# EAGLE design Adafruit ItsyBitsy M0 (EAGLE 9.4.2)
REV: 0.1
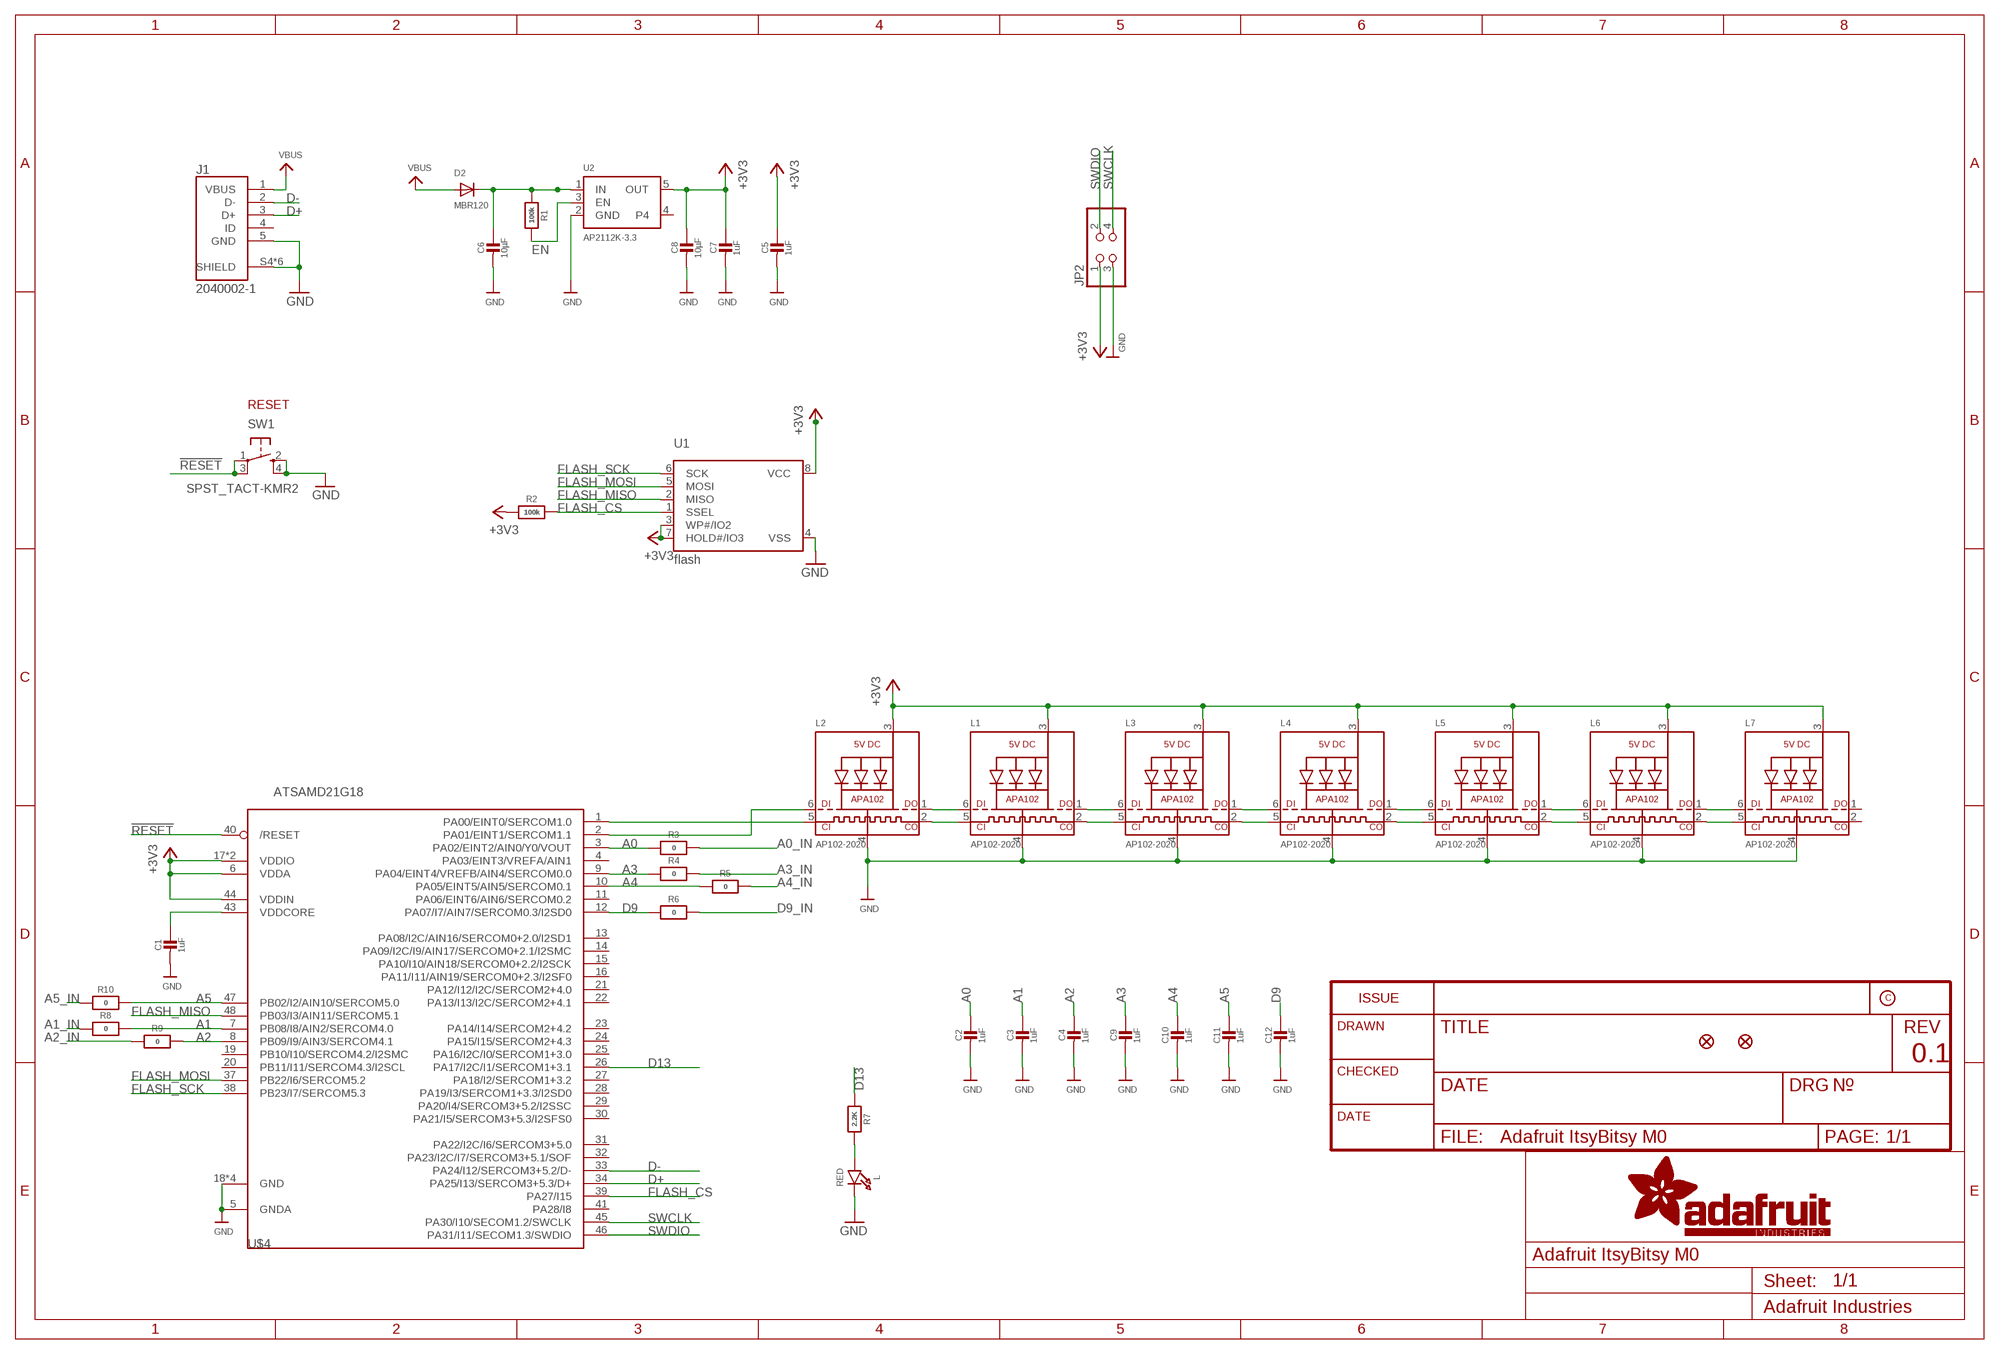
[diagram p0: schematic, sheet 1]

## Parts
C1  1uF  CAP_CERAMIC0603_NO  [0603-NO]
C2  1uF  CAP_CERAMIC0603_NO  [0603-NO]
C3  1uF  CAP_CERAMIC0603_NO  [0603-NO]
C4  1uF  CAP_CERAMIC0603_NO  [0603-NO]
C5  1uF  CAP_CERAMIC0603_NO  [0603-NO]
C6  10µF  CAP_CERAMIC0805-NOOUTLINE  [0805-NO]
C7  1uF  CAP_CERAMIC0603_NO  [0603-NO]
C8  10µF  CAP_CERAMIC0805-NOOUTLINE  [0805-NO]
C9  1uF  CAP_CERAMIC0603_NO  [0603-NO]
C10  1uF  CAP_CERAMIC0603_NO  [0603-NO]
C11  1uF  CAP_CERAMIC0603_NO  [0603-NO]
C12  1uF  CAP_CERAMIC0603_NO  [0603-NO]
D2  MBR120  DIODE_SOD-123FL  [SOD-123FL]
J1  2040002-1  [TE_2040002-1]
JP2  PINHD-2X2  [2X02]
L  RED  LED0805_NOOUTLINE  [CHIPLED_0805_NOOUTLINE]
L1  AP102-2020  APA1022020  [APA102_2020]
L2  AP102-2020  APA1022020  [APA102_2020]
L3  AP102-2020  APA1022020  [APA102_2020]
L4  AP102-2020  APA1022020  [APA102_2020]
L5  AP102-2020  APA1022020  [APA102_2020]
L6  AP102-2020  APA1022020  [APA102_2020]
L7  AP102-2020  APA1022020  [APA102_2020]
R1  100k  RESISTOR_0603_NOOUT  [0603-NO]
R2  100k  RESISTOR_0603_NOOUT  [0603-NO]
R3  0  RESISTOR_0603_NOOUT  [0603-NO]
R4  0  RESISTOR_0603_NOOUT  [0603-NO]
R5  0  RESISTOR_0603_NOOUT  [0603-NO]
R6  0  RESISTOR_0603_NOOUT  [0603-NO]
R7  2.2K  RESISTOR_0603_NOOUT  [0603-NO]
R8  0  RESISTOR_0603_NOOUT  [0603-NO]
R9  0  RESISTOR_0603_NOOUT  [0603-NO]
R10  0  RESISTOR_0603_NOOUT  [0603-NO]
SW1  SPST_TACT-KMR2  [KMR2]
U1  flash  SPIFLASH_8PINUX  [USON8]
U2  AP2112K-3.3  VREG_SOT23-5  [SOT23-5]
U$4  ATSAMD21G18  ATSAMD21G_QFN  [TQFN48_7MM]
U$34  FIDUCIAL_1MM  [FIDUCIAL_1MM]
U$35  FIDUCIAL_1MM  [FIDUCIAL_1MM]

## Nets
!RESET: SW1.1(P) SW1.3(P1) U$4.40(/RESET)
+3V3: C5.1 C7.1 C8.1 JP2.1 L1.3(VDD) L2.3(VDD) L3.3(VDD) L4.3(VDD) L5.3(VDD) L6.3(VDD) L7.3(VDD) R2.1 U1.3(WP#/IO2) U1.7(HOLD#/IO3) U1.8(VCC) U2.5(OUT) U$4.6(VDDA) U$4.17(VDDIO) U$4.36(VDDIO) U$4.44(VDDIN)
A0: C2.1 R3.1 U$4.3(PA02/EINT2/AIN0/Y0/VOUT)
A0_IN: R3.2
A1: C3.1 R8.2 U$4.7(PB08/I8/AIN2/SERCOM4.0)
A1_IN: R8.1
A2: C4.1 R9.2 U$4.8(PB09/I9/AIN3/SERCOM4.1)
A2_IN: R9.1
A3: C9.1 R4.1 U$4.9(PA04/EINT4/VREFB/AIN4/SERCOM0.0)
A3_IN: R4.2
A4: C10.1 R5.1 U$4.10(PA05/EINT5/AIN5/SERCOM0.1)
A4_IN: R5.2
A5: C11.1 R10.2 U$4.47(PB02/I2/AIN10/SERCOM5.0)
A5_IN: R10.1
D9: C12.1 R6.1 U$4.12(PA07/I7/AIN7/SERCOM0.3/I2SD0)
D9_IN: R6.2
D13: R7.1 U$4.26(PA17/I2C/I1/SERCOM1+3.1)
D+: J1.3(D+) U$4.34(PA25/I13/SERCOM3+5.3/D+)
D-: J1.2(D-) U$4.33(PA24/I12/SERCOM3+5.2/D-)
EN: R1.2 U2.3(EN)
FLASH_CS: R2.2 U1.1(SSEL) U$4.39(PA27/I15)
FLASH_MISO: U1.2(MISO) U$4.48(PB03/I3/AIN11/SERCOM5.1)
FLASH_MOSI: U1.5(MOSI) U$4.37(PB22/I6/SERCOM5.2)
FLASH_SCK: U1.6(SCK) U$4.38(PB23/I7/SERCOM5.3)
GND: C1.2 C2.2 C3.2 C4.2 C5.2 C6.2 C7.2 C8.2 C9.2 C10.2 C11.2 C12.2 J1.5(GND) J1.S4(SHIELD) J1.S5(SHIELD) J1.SH1(SHIELD) J1.SH2(SHIELD) J1.SH3(SHIELD) J1.SH4(SHIELD) JP2.3 L1.4(GND) L2.4(GND) L3.4(GND) L4.4(GND) L5.4(GND) L6.4(GND) L7.4(GND) L.C SW1.2(S) SW1.4(S1) U1.4(VSS) U2.2(GND) U$4.5(GNDA) U$4.18(GND) U$4.35(GND) U$4.42(GND) U$4.THERMAL(GND)
N$1: L2.5(CKI) U$4.1(PA00/EINT0/SERCOM1.0)
N$2: L.A R7.2
N$3: L1.6(DI) L2.1(DO)
N$4: L1.5(CKI) L2.2(CKO)
N$5: L2.6(DI) U$4.2(PA01/EINT1/SERCOM1.1)
N$6: L1.1(DO) L3.6(DI)
N$7: L1.2(CKO) L3.5(CKI)
N$8: L3.1(DO) L4.6(DI)
N$9: L3.2(CKO) L4.5(CKI)
N$10: L4.1(DO) L5.6(DI)
N$11: L4.2(CKO) L5.5(CKI)
N$12: L5.1(DO) L6.6(DI)
N$13: L5.2(CKO) L6.5(CKI)
N$14: L6.1(DO) L7.6(DI)
N$15: L6.2(CKO) L7.5(CKI)
SWCLK: JP2.4 U$4.45(PA30/I10/SECOM1.2/SWCLK)
SWDIO: JP2.2 U$4.46(PA31/I11/SECOM1.3/SWDIO)
VBUS: D2.A J1.1(VBUS)
VDDCORE: C1.1 U$4.43(VDDCORE)
VHI: C6.1 D2.C R1.1 U2.1(IN)
Unconnected: J1.4(ID) L7.1(DO) L7.2(CKO) U2.4 U$4.4(PA03/EINT3/VREFA/AIN1) U$4.11(PA06/EINT6/AIN6/SERCOM0.2) U$4.13(PA08/I2C/AIN16/SERCOM0+2.0/I2SD1) U$4.14(PA09/I2C/I9/AIN17/SERCOM0+2.1/I2SMC) U$4.15(PA10/I10/AIN18/SERCOM0+2.2/I2SCK) U$4.16(PA11/I11/AIN19/SERCOM0+2.3/I2SF0) U$4.19(PB10/I10/SERCOM4.2/I2SMC) U$4.20(PB11/I11/SERCOM4.3/I2SCL) U$4.21(PA12/I12/I2C/SERCOM2+4.0) U$4.22(PA13/I13/I2C/SERCOM2+4.1) U$4.23(PA14/I14/SERCOM2+4.2) U$4.24(PA15/I15/SERCOM2+4.3) U$4.25(PA16/I2C/I0/SERCOM1+3.0) U$4.27(PA18/I2/SERCOM1+3.2) U$4.28(PA19/I3/SERCOM1+3.3/I2SD0) U$4.29(PA20/I4/SERCOM3+5.2/I2SSC) U$4.30(PA21/I5/SERCOM3+5.3/I2SFS0) U$4.31(PA22/I2C/I6/SERCOM3+5.0) U$4.32(PA23/I2C/I7/SERCOM3+5.1/SOF) U$4.41(PA28/I8)

## Notes on the sheet
- RESET

## Library data of the parts
C1 C5 C7 = microbuilder:CAP_CERAMIC: Ceramic Capacitors For new designs, use the packages preceded by an '_' character since they are more reliable: The following footprints should be used on most boards: _0402 - Standard footprint for regular board layouts _0603 - Standard footprint for regular board layouts _0805 - Standard footprint for regular board layouts _1206 - Standard footprint for regular board layouts For extremely tight-pitch boards where space is at a premium, the following 'micro-pitch' footprints can be used (smaller pads, no silkscreen outline, etc.): _0402MP - Micro-pitch footprint for very dense/compact boards _0603MP - Micro-pitch footprint for very dense/compact boards _0805MP - Micro-pitch footprint for very dense/compact boards _1206MP - Micro-pitch footprint for very dense/compact boards; DK_PN: 399-17705-1-ND; JLC_PN: 1uF
C2-C4 C9-C12 = microbuilder:CAP_CERAMIC: Ceramic Capacitors For new designs, use the packages preceded by an '_' character since they are more reliable: The following footprints should be used on most boards: _0402 - Standard footprint for regular board layouts _0603 - Standard footprint for regular board layouts _0805 - Standard footprint for regular board layouts _1206 - Standard footprint for regular board layouts For extremely tight-pitch boards where space is at a premium, the following 'micro-pitch' footprints can be used (smaller pads, no silkscreen outline, etc.): _0402MP - Micro-pitch footprint for very dense/compact boards _0603MP - Micro-pitch footprint for very dense/compact boards _0805MP - Micro-pitch footprint for very dense/compact boards _1206MP - Micro-pitch footprint for very dense/compact boards
C6 C8 = microbuilder:CAP_CERAMIC: Ceramic Capacitors For new designs, use the packages preceded by an '_' character since they are more reliable: The following footprints should be used on most boards: _0402 - Standard footprint for regular board layouts _0603 - Standard footprint for regular board layouts _0805 - Standard footprint for regular board layouts _1206 - Standard footprint for regular board layouts For extremely tight-pitch boards where space is at a premium, the following 'micro-pitch' footprints can be used (smaller pads, no silkscreen outline, etc.): _0402MP - Micro-pitch footprint for very dense/compact boards _0603MP - Micro-pitch footprint for very dense/compact boards _0805MP - Micro-pitch footprint for very dense/compact boards _1206MP - Micro-pitch footprint for very dense/compact boards; DK_PN: 490-14381-1-ND; JLC_PN: 10uF
D2 = adafruit:DIODE: Diode SMADIODE - SMA Surface Mount Package 20V 1A Schottky Diode Digikey: 641-1014-6-ND DO-1N4148 - Through Hole Small Current Diode SOD-123 20V 1 A (.5mV Vf) Schottky Diode - Digikey: MBRX120TPMSCT-ND SOD-323 10V 570mA (.38mV Vf, 3ns) Schottky Diode - Digikey: ZLLS410CT-ND SOD-523 30V 30mA Schottky Diode (RB751S-40TE61) - Digikey: RB751S-40TE61CT-ND SOT23-R/W - SOT23 Package (R = Solder Paste/Reflow Ovens, W = Hand-Soldering) BAT54Film 40V 300mA - Digikey: 497-7162-1-ND; DK_PN: MBR120LSFT1GOSCT-ND; JLC_PN: MBR120LSF
J1 = 2040002-1:2040002-1: Conn USB Type B RCP 5 POS 0.65mm Solder RA SMD 5 Terminal 1 Port T/R; AVAILABILITY: Unavailable; CENTERLINE_PITCH: .65 mm[.025 in]; COMMENT: 2040002-1; DESCRIPTION: Conn Micro USB 2.0 Type B RCP 5 POS 0.65mm Solder RA SMD 5 Terminal 1 Port T/R; DK_PN: A108263CT-ND; MF: TE Connectivity; MP: 2040002-1; NUMBER_OF_POSITIONS: 5; PACKAGE: None; PN: 2040002-1; PRICE: None; PRODUCT_TYPE: Connector; TE_PURCHASE_URL: https://www.te.com/usa-en/product-2040002-1.html?te_bu=Cor&te_type=disp&te_campaign=seda_glo_cor-seda-global-disp-prtnr-fy19-seda-model-bom-cta_sma-317_1&elqCampaignId=32493
JP2 = pinhead:PINHD-2X2: PIN HEADER
L = microbuilder:LED: LED 0603 - 0603 Surface Mount Package 2mA: Green LED - Low Power (3.9mcd, 2ma, 1.7Vf) - Digikey: 475-2709-2-ND Orange LED - Low Power (9.8mcd, 2ma, 1.8Vf) - Digikey: 475-1194-2-ND Red LED - Low Power (5mcd, 2ma, 1.8Vf) - Digikey: 475-1195-2-ND Yellow LED - Low Power (7mcd, 2ma, 1.8Vf) - Digikey: 475-1196-2-ND 5mA: Blue LED - Low Power (17mcd, 5ma, 2.9Vf) - Digikey: LNJ937W8CRACT-ND 0805 - 0805 Surface Mount Package 2mA: Red LED (8.8mcd, 2mA, 1.8Vf, Clear) - Low Power [Digikey: 475-2510-1-ND] Green LED (5mcd, 2mA, 1.8Vf, Clear) - Low Power [Digikey: 475-2730-1-ND] Yellow LED (11.3mcd, 2mA, 1.8Vf, Clear) - Low Power [Digikey: 475-2555-1-ND] 20mA: Red LED (104mcd, 20mA, Diffused) - LS R976 [Digikey: 475-1278-6-ND] Red LED (12mcd, 20mA, 2.0Vf, Clear) - APT2012EC [Digikey: 754-1128-1-ND] Green LED (15mcd, 20mA, 2.2Vf, Clear) - APT2012GC [Digikey: 754-1131-1-ND] Orange LED (160mcd, 20mA, 2.1Vf, Clear) - APT2012SECK [Digikey: 754-1130-1-ND] 1206 - 1206 Surface Mount Package Green LED (26mcd, 20mA, Diffused) - LG N971 [Digikey: 475-1407-6-ND] Red LED (15mcd, 20mA, Diffused) - LH N974 [Digikey: 475-1416-6-ND] Cree - Cree High-Power Surface Mount LEDs XPEBWT-L1-0000-00D50 - White 111lm 350mA 2.9Vf 6200K 110° XTEAWT-00-0000-00000LEE3 - White 114lm 350mA 2.85Vf 5000K 115° Everlight - Everlight 45-21 Series Surface Mount LEDs 45-21/QK2C-B2832AC2CB2/2T - Warm White 2000mcd 20mA 3.25Vf 3050K 120° 45-21/LK2C-B38452C4CB2/2T - Nuetral White 2000mcd 20mA 3.25Vf 4150K 120° 45-21/LK2C-B50634C6CB2/2T - Cold White 2200mcd 20mA 3.25Vf 5650K 120° PLCC2 Reverse Mount LS T77K-J1L2-1-0-2-R18-Z - Red 11.25mcd 2mA 1.8Vf 630nm 120° LO T77K-L1M2-24-Z - Orange 19.6mcd 2mA 1.8Vf 606nm 120° LY T77K-K2M1-26-Z - Yellow 15.7mcd 2mA 1.8Vf 587nm 120°; DK_PN: 475-1415-1-ND; JLC_PN: RED LED
L1-L7 = microbuilder:APA102: APA102/DotStar Pixels VCC: 5V DC Refresh Rate: 400Hz; DK_PN: 1528-1826-ND; PN: 3341
R1 R2 = microbuilder:RESISTOR: Resistors For new designs, use the packages preceded by an '_' character since they are more reliable: The following footprints should be used on most boards: _0402 - Standard footprint for regular board layouts _0603 - Standard footprint for regular board layouts _0805 - Standard footprint for regular board layouts _1206 - Standard footprint for regular board layouts For extremely tight-pitch boards where space is at a premium, the following 'micro-pitch' footprints can be used (smaller pads, no silkscreen outline, etc.): _0402MP - Micro-pitch footprint for very dense/compact boards _0603MP - Micro-pitch footprint for very dense/compact boards _0805MP - Micro-pitch footprint for very dense/compact boards _1206MP - Micro-pitch footprint for very dense/compact boards; DK_PN: P100KDBCT-ND; JLC_PN: 100k
R3-R6 R8-R10 = microbuilder:RESISTOR: Resistors For new designs, use the packages preceded by an '_' character since they are more reliable: The following footprints should be used on most boards: _0402 - Standard footprint for regular board layouts _0603 - Standard footprint for regular board layouts _0805 - Standard footprint for regular board layouts _1206 - Standard footprint for regular board layouts For extremely tight-pitch boards where space is at a premium, the following 'micro-pitch' footprints can be used (smaller pads, no silkscreen outline, etc.): _0402MP - Micro-pitch footprint for very dense/compact boards _0603MP - Micro-pitch footprint for very dense/compact boards _0805MP - Micro-pitch footprint for very dense/compact boards _1206MP - Micro-pitch footprint for very dense/compact boards; DK_PN: P0.0GCT-ND; JLC_PN: 0
R7 = microbuilder:RESISTOR: Resistors For new designs, use the packages preceded by an '_' character since they are more reliable: The following footprints should be used on most boards: _0402 - Standard footprint for regular board layouts _0603 - Standard footprint for regular board layouts _0805 - Standard footprint for regular board layouts _1206 - Standard footprint for regular board layouts For extremely tight-pitch boards where space is at a premium, the following 'micro-pitch' footprints can be used (smaller pads, no silkscreen outline, etc.): _0402MP - Micro-pitch footprint for very dense/compact boards _0603MP - Micro-pitch footprint for very dense/compact boards _0805MP - Micro-pitch footprint for very dense/compact boards _1206MP - Micro-pitch footprint for very dense/compact boards; DK_PN: P2.2KDBCT-ND; JLC_PN: 2.2k
SW1 = adafruit:SPST_TACT: SMT 6mm switch, EVQQ2 series http://www.ladyada.net/library/eagle; DK_PN: 401-1426-1-ND; PN: KMR211GLFS
U1 = microbuilder:SPIFLASH_8PIN: SOIC8 SPI Flash Be careful with the size since SOIC8 flash comes in several 'widths' SOIC8 150 mil M25P16 - 16Mbit (2Mbit x 8) Serial Flash (75MHz SPI Bus), Supply: 2.7-3.6V Digikey: SOIC8 - M25P16-VMN6P-ND SOIC8 208 mil W25Q16BVSSIG - 16Mbit (2Mbit x 8) Serial Flash (104MHz SPI Bus), Supply: 2.7-3.6V Digikey: SOIC8 - W25Q16BVSSIG-ND; DK_PN: 1092-1184-1-ND; PN: MX25R2035FZUIL0
U2 = microbuilder:VREG_SOT23-5: SOT23-5 Fixed Voltage Regulators Part Current Out V Out V In V Dropout θJA (°C/W) TJ (°C) Digikey Part No. ADP121 150mA 3.3V 3.4-5.5V 0.09V @ 150mA -- -- ADP121-AUJZ33R7CT-ND ADP121 150mA 3.0V 3.1-5.5V 0.09V @ 150mA -- -- ADP121-AUJZ30R7CT-ND ADP122 300mA 3.3V 3.4-5.5V 0.085V @ 300mA -- -- ADP122AUJZ-3.3-R7CT-ND ADP1712 300mA 3.3V 3.5-5.5V 0.17V @ 300mA -- -- ADP1712AUJZ-3.3-R7TR-ND AP7311 (Low Cost) 150mA 3.3V 3.5-6V 0.15V @ 150mA -- -- AP7311-33WG-7DICT-ND LD39015M18R 150mA 1.8V 1.9V-5.5V 0.08V @ 100mA -- -- 497-6977-1-ND LP2985A-33DBVR 150mA 3.3V 3.3-16V 0.28V @ 150mA 206 150 296-18479-1-ND MCP1824T-3302E/OT 300mA 3.3V 3.5V-6V 0.2V @ 300mA -- -- MCP1824T-3302E/OTCT-ND MIC5205-2.5YM5 TR 150mA 2.5V 2.7-16V 0.165V @ 150mA -- -- 576-1257-2-ND MIC5205-3.0YM5 TR 150mA 3.0V 3.2V-16V 0.165V @ 150mA -- -- 576-1258-2-ND MIC5205-3.3YM5 TR 150mA 3.3V 3.5V-16V 0.165V @ 150mA -- -- 576-1259-2-ND TPS780330220 150mA 3.3V+2.2V 3.6-5.5V 250mV Max -- -- 296-23332-1-ND TDA3663/N1,135 100mA 3.3V 3.5-45V 0.18V @ 50mA -- -- 568-5343-1-ND Max operating temp can be calculated using θJA, TJ (max junction temperature), and power in watts. Set the "Maximum Ambient Temperature" until it reaches TJ ("Max Junction Temperature"), which is the absolute limit for safe use of the regulator: Heat Sink Temperature Calculator <http://www.daycounter.com/Calculators/Heat-Sink-Temperature-Calculator.phtml> For example, With 12V source into a 3.3V LP2985 and a 30mA load, we are dissipating (12V-3.3V) * 0.03A = 0.261W. With a θJA of 206 °C/W, a TJ of 150°C, and 261mW we can safely use the chip without a heat sink up to 75°C (=147.1°C Junction Temperature).; DK_PN: AP2112K-3.3TRG1DICT-ND; JLC_PN: AP2112K-3.3TRG1; PN: AP2112K-3.3TRG1
U$4 = microbuilder:ATSAMD21G; DK_PN: ATSAMD21G18A-MU-ND; PN: ATSAMD21G18A-MU
U$34 U$35 = microbuilder:FIDUCIAL: Fiducial Alignment Points Various fiducial points for machine vision alignment.; BOM: EXCLUDE

## Board
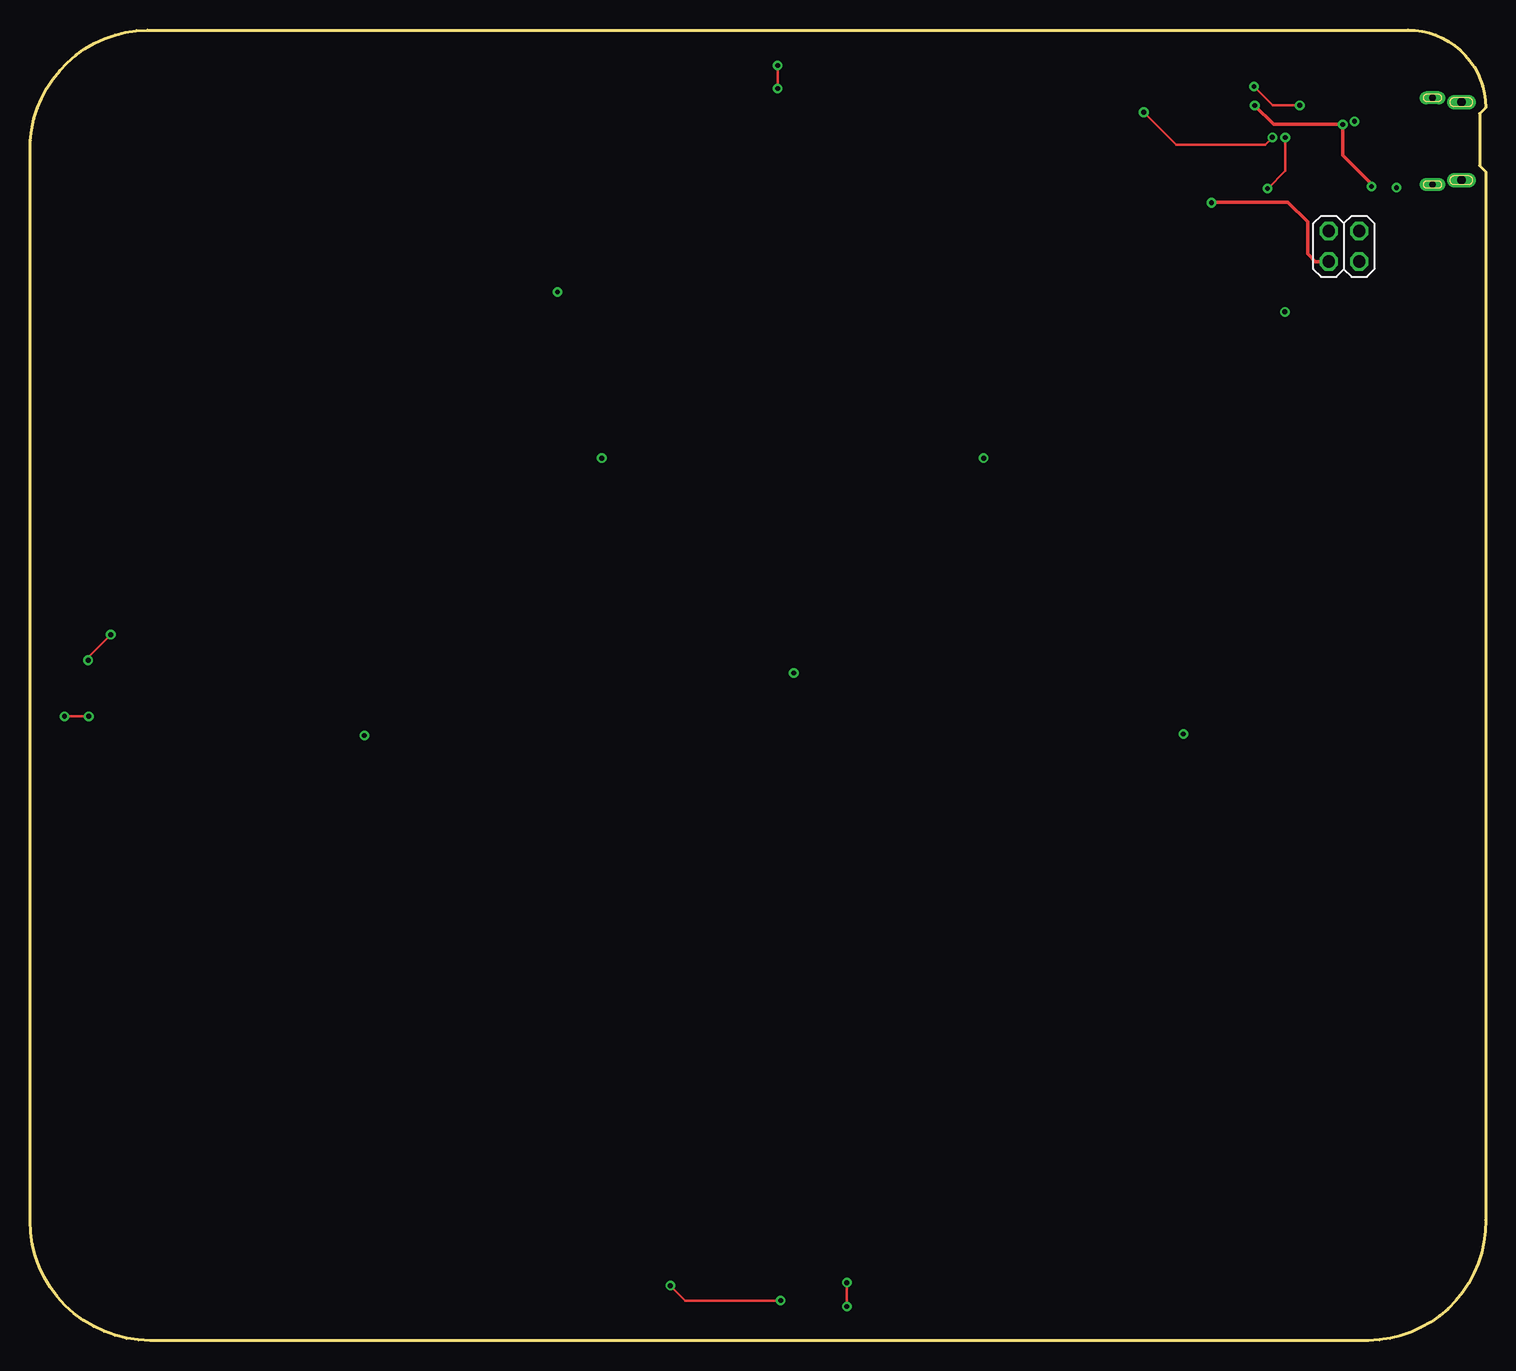
[diagram p1: board, top side]
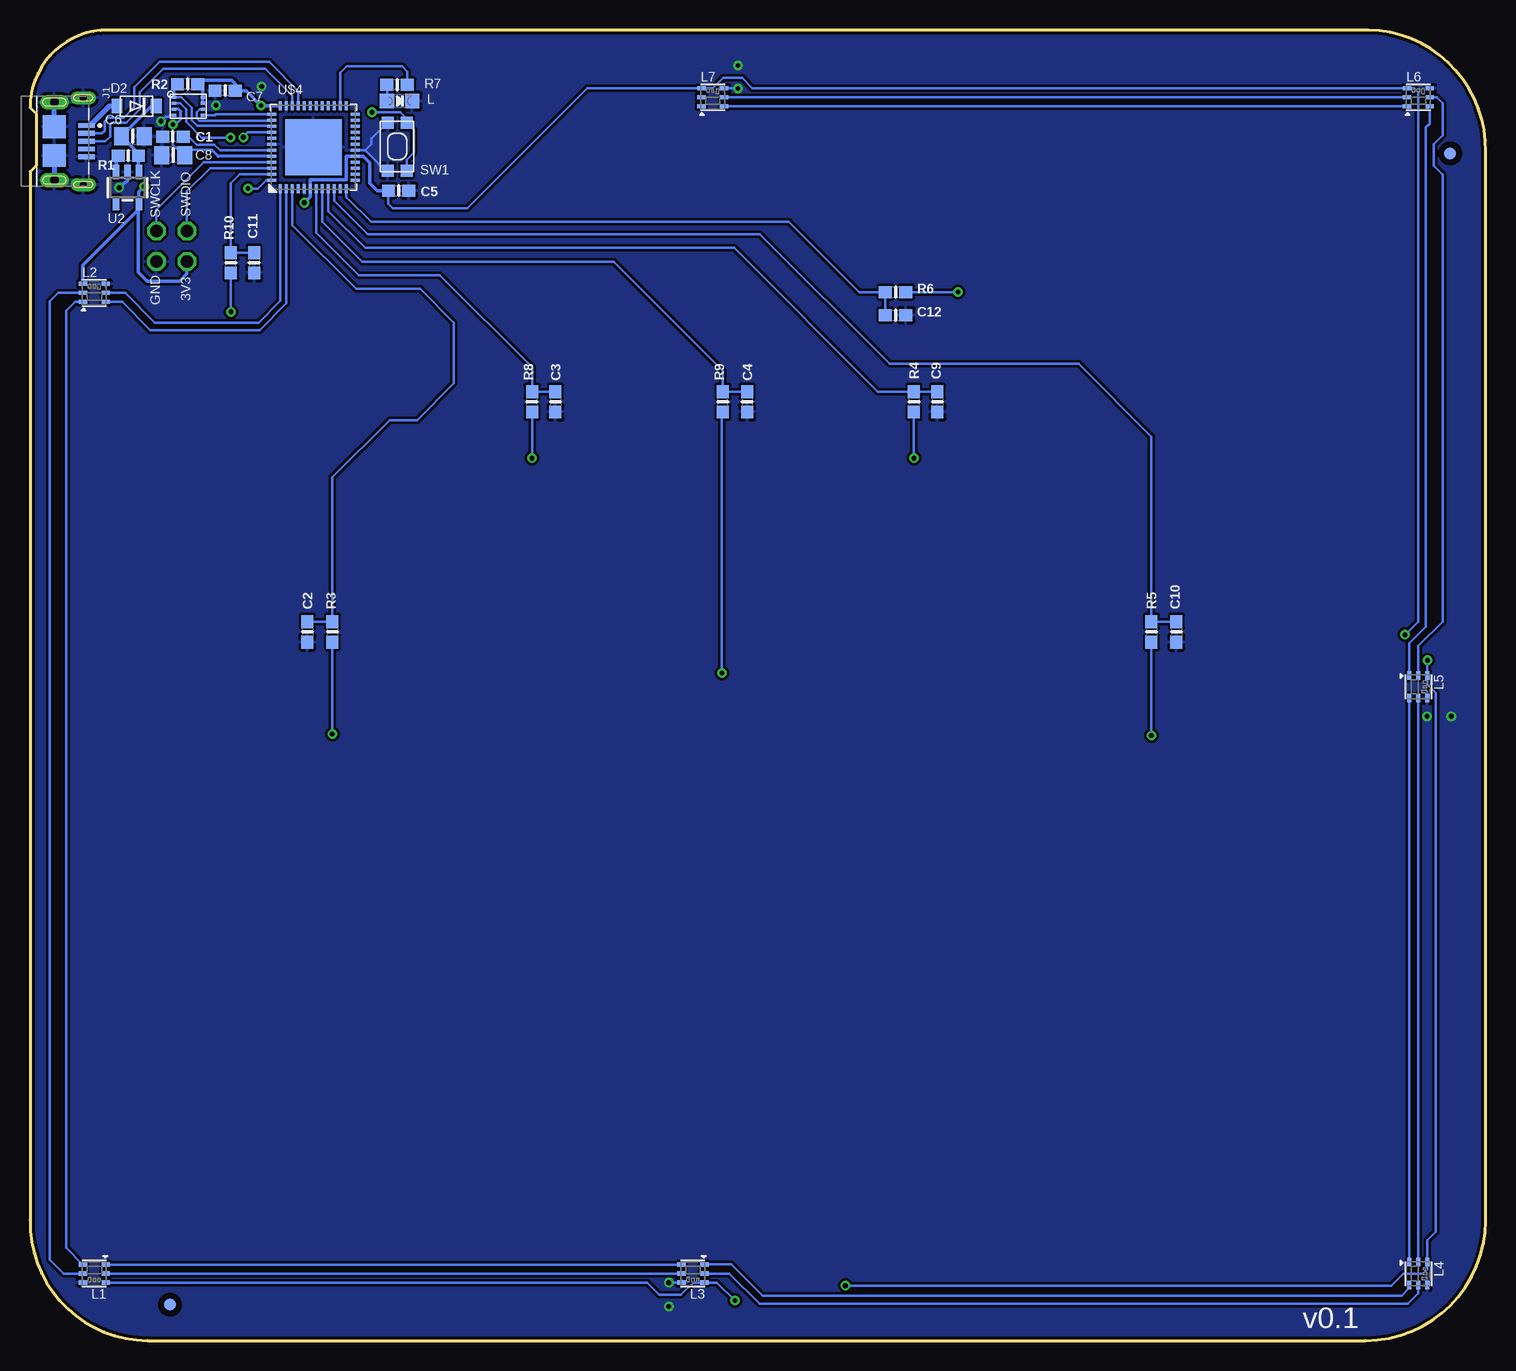
[diagram p2: board, bottom side, seen from below]

Size 121.31 x 109.21 mm. Coordinates in mm from the lower left corner, seen from the top.
Outline: 121.31,97.41 121.31,10.03 arc-90 111.54,0 10,0 arc-90 0,9.98 0,99.08 arc-90 9.78,109.21 114.83,109.21 arc-90 121.31,102.74 120.8,102.23 120.8,97.92 121.31,97.41
Copper layers (1*16): Top 0.035mm / dielectric 1.5mm / Bottom 0.035mm
Design rules "adafruit *": minimum track width 8mil, minimum drill 15.5mil, track to track 8mil, track to pad 8mil, pad to pad 8mil, via to via 8mil, smd to smd 8mil, copper to edge 10mil, drill to drill 8mil, minimum pad ring 10mil, minimum via ring 8mil, stop-mask expansion 2mil, vias tented up to drill 20mil, thermal gap 10mil

### Footprints (pad centres in the part's own frame; a part is rotated, then mirrored left to right if it is on the bottom)
0603-NO = smd 1.075 x 1: 1 -0.85,0; 2 0.85,0
0805-NO = smd 1.24 x 1.5: 1 -0.95,0; 2 0.95,0
SOD-123FL = smd 0.91 x 1.22: A 1.637,0; C -1.637,0
TE_2040002-1 = smd 0.4 x 1.35: 1 -1.3,2.675; 2 -0.65,2.675; 3 0,2.675; 4 0.65,2.675; 5 1.3,2.675 | smd 1.9 x 1.9: S4 -1.2,0; S5 1.2,0 | drill 0.56 long: SH1 -3.615,2.4; SH2 3.615,2.4 | drill 0.71 long: SH3 3.255,0; SH4 -3.255,0
2X02 = drill 1.016 octagon: 1 -1.27,-1.27; 2 -1.27,1.27; 3 1.27,-1.27; 4 1.27,1.27
CHIPLED_0805_NOOUTLINE = smd 1.2 x 1.2: A 0,-1.05; C 0,1.05
APA102_2020 = smd 0.7 x 0.35: 1 -0.95,-0.75; 2 -0.95,0; 3 -0.95,0.75; 4 0.95,0.75; 5 0.95,0; 6 0.95,-0.75
KMR2 = smd 1 x 1: 1 2,0.8; 2 2,-0.8; 3 -2,0.8; 4 -2,-0.8
USON8 = smd 0.35 x 0.25: 1 -1.2,0.75; 2 -1.2,0.25; 3 -1.2,-0.25; 4 -1.2,-0.75; 5 1.2,-0.75; 6 1.2,-0.25; 7 1.2,0.25; 8 1.2,0.75
SOT23-5 = smd 0.55 x 1.2: 1 -0.95,-1.3; 2 0,-1.3; 3 0.95,-1.3; 4 0.95,1.3; 5 -0.95,1.3
TQFN48_7MM = smd 0.25 x 0.75: 1 -2.75,-3.475; 2 -2.25,-3.475; 3 -1.75,-3.475; 4 -1.25,-3.475; 5 -0.75,-3.475; 6 -0.25,-3.475; 7 0.25,-3.475; 8 0.75,-3.475; 9 1.25,-3.475; 10 1.75,-3.475; 11 2.25,-3.475; 12 2.75,-3.475; 25 2.75,3.475; 26 2.25,3.475; 27 1.75,3.475; 28 1.25,3.475; 29 0.75,3.475; 30 0.25,3.475; 31 -0.25,3.475; 32 -0.75,3.475; 33 -1.25,3.475; 34 -1.75,3.475; 35 -2.25,3.475; 36 -2.75,3.475 | smd 0.75 x 0.25: 13 3.475,-2.75; 14 3.475,-2.25; 15 3.475,-1.75; 16 3.475,-1.25; 17 3.475,-0.75; 18 3.475,-0.25; 19 3.475,0.25; 20 3.475,0.75; 21 3.475,1.25; 22 3.475,1.75; 23 3.475,2.25; 24 3.475,2.75; 37 -3.475,2.75; 38 -3.475,2.25; 39 -3.475,1.75; 40 -3.475,1.25; 41 -3.475,0.75; 42 -3.475,0.25; 43 -3.475,-0.25; 44 -3.475,-0.75; 45 -3.475,-1.25; 46 -3.475,-1.75; 47 -3.475,-2.25; 48 -3.475,-2.75 | smd 4.7 x 4.7: THERMAL 0,0
FIDUCIAL_1MM = smd 1 x 1: 1 0,0

### Placement (x,y rotation side)
C1  109.4,100.33 180 bottom
C2  98.19,59.06 270 bottom
C3  77.52,78.23 270 bottom
C4  61.54,78.23 270 bottom
C5  90.59,95.82 0 bottom
C6  112.73,100.37 0 bottom
C7  105.04,104.16 180 bottom
C8  109.37,98.79 180 bottom
C9  45.69,78.23 270 bottom
C10  25.78,59.06 270 bottom
C11  102.64,89.81 270 bottom
C12  49.17,85.45 0 bottom
D2  112.42,102.87 180 bottom
J1  119.28,99.95 270 bottom
JP2  109.5,91.19 0 top
L  90.5,103.29 270 bottom
L1  115.95,5.59 180 bottom
L2  115.95,87.31 0 bottom
L3  66.06,5.59 180 bottom
L4  5.61,5.59 270 bottom
L5  5.61,54.48 270 bottom
L6  5.61,103.61 0 bottom
L7  64.41,103.61 0 bottom
R1  113.12,98.74 180 bottom
R2  108.16,104.71 180 bottom
R3  96.11,59.06 270 bottom
R4  47.65,78.23 270 bottom
R5  27.86,59.06 270 bottom
R6  49.17,87.38 0 bottom
R7  90.71,104.65 180 bottom
R8  79.47,78.23 90 bottom
R9  63.57,78.23 90 bottom
R10  104.57,89.81 90 bottom
SW1  90.71,99.5 270 bottom
U1  108.1,102.87 0 bottom
U2  113.18,96.08 180 bottom
U$4  97.69,99.44 0 bottom
U$14  [ITSYM0_TOP]  121.31,91.06 0 bottom
U$15  [ITSYM0_BOT]  85.75,91.06 0 top
U$34  2.96,98.93 270 bottom
U$35  109.64,2.99 270 bottom

### Tracks (layer width: path | path; a pad name or v marks a point on that pad's centre or on a via)
!RESET  (via drill 0.39)
  Top 0.203: v103.53,100.27 103.53,100.2 102.96,99.63 95.54,99.63 v92.81,102.36
  Bottom 0.203: SW1.1 89.91,98.4 89.32,99 89.32,100.9 SW1.3 89.91,101.82 90.46,102.36 v92.81,102.36 | U$4.40 103.17,100.69 103.53,100.33 v103.53,100.27
+3V3  (via drill 0.39)
  Top 0.203: v4.85,56.69 4.85,56.95 v6.73,58.83 | v53.36,4.57 54.61,3.33 v62.56,3.33
  Top 0.305: v111.78,96.18 111.78,96.39 109.4,98.78 v109.4,101.35 103.63,101.35 v102.06,102.92 | JP2.1 107.11,89.92 106.47,90.55 106.47,93.22 104.82,94.87 98.5,94.87 v98.45,94.82
  Bottom 0.203: R2.1 107.05,104.45 106.9,104.45 | v109.4,101.35 109.4,99.66 108.53,98.79 C8.1 107.98,99.23 106.17,99.23 | v53.36,4.57 7.87,4.57 6.86,5.59 5.23,5.59 4.86,5.96 L4.3 4.86,8.37 4.16,9.07 4.16,53.98 4.86,54.67 L5.3 4.86,56.68 v4.85,56.69 | 91.46,95.82 91.46,94.74 91.08,94.36 84.86,94.36 74.86,104.36 L7.3 64.42,104.36 63.56,105.22 61.97,105.22 61.11,104.36 L6.3 5.96,104.36 5.61,104.01 5.61,59.92 6.7,58.83 v6.73,58.83 | v62.56,3.33 64.07,4.84 L3.3 66.06,4.84 67.07,3.82 68.86,3.82 69.87,4.84 L1.3
  Bottom 0.254: U$4.44 105.64,98.69 106.17,99.23 | U1.3 108.93,102.62 108.74,102.42 108.74,101.79 109.18,101.35 v109.4,101.35
  Bottom 0.305: U1.7 U1.8 106.9,104.45 | L2.3 116.9,89.63 112.29,94.23 | C5.1 91.46,95.82 92.36,95.82 92.99,96.46 92.99,98.13 93.55,98.69 U$4.17 94.97,98.69 94.97,96.72 97.94,96.72 U$4.6 97.94,95.33 v98.45,94.82 | R2.1 107,105.03 104.48,105.03 104.19,104.74 C7.1 103.3,104.16 v102.06,102.92 U$4.36 | v111.78,96.18 112.23,95.73 U2.5 112.29,94.71 112.29,94.23 | JP2.1 108.23,88.88 108.85,88.27 111.53,88.27 112.29,89.03 112.29,94.23
A0
  Bottom 0.203: U$4.3 99.44,92.94 94.13,87.63 88.8,87.63 86,84.84 86,79.76 89.05,76.71 91.34,76.71 96.11,71.93 R3.1 C2.1
A0_IN  (via drill 0.39)
  Bottom 0.203: R3.2 v96.11,50.55
A1
  Bottom 0.203: U$4.7 97.44,92.31 93.9,88.77 87.15,88.77 79.47,81.1 R8.2 C3.1
A1_IN  (via drill 0.39)
  Bottom 0.203: R8.1 v79.47,73.53
A2
  Bottom 0.203: U$4.8 96.94,93.23 93.62,89.92 72.67,89.92 63.57,80.82 R9.2 C4.1
A2_IN  (via drill 0.39)
  Bottom 0.203: R9.1 63.65,77.31 v63.65,55.63
A3
  Bottom 0.203: U$4.9 96.44,94.13 93.37,91.06 62.63,91.06 50.66,79.08 R4.1 C9.1
A3_IN  (via drill 0.39)
  Bottom 0.203: R4.2 v47.65,73.53
A4
  Bottom 0.203: U$4.10 95.94,95 93.14,92.2 60.48,92.2 49.68,81.41 33.93,81.41 27.86,75.34 R5.1 C10.1
A4_IN  (via drill 0.39)
  Bottom 0.203: R5.2 27.86,50.44 v27.86,50.42
A5
  Bottom 0.203: U$4.47 103.82,97.19 104.57,96.44 R10.2 C11.1
A5_IN  (via drill 0.39)
  Bottom 0.203: R10.1 104.57,85.85 v104.57,85.73
D9
  Bottom 0.203: U$4.12 94.94,95.26 92.89,93.22 58.06,93.22 52.22,87.38 R6.1 C12.1
D9_IN  (via drill 0.39)
  Bottom 0.203: R6.2 v43.97,87.38
D13
  Bottom 0.203: U$4.26 95.44,105.65 94.92,106.17 90.3,106.17 89.86,105.74 R7.1
D+
  Bottom 0.203: U$4.34 99.44,103.73 101.69,105.98 110.2,105.98 112.16,104.01 112.16,102.62 113.31,101.47 114.51,101.47 114.64,101.35 114.64,100.33 115.02,99.95 J1.3
D-
  Bottom 0.203: U$4.33 98.94,104.12 101.37,106.55 110.51,106.55 112.61,104.46 112.61,102.81 113.5,101.92 114.77,101.92 115.09,101.6 115.09,100.84 115.32,100.6 J1.2
EN
  Bottom 0.305: U2.3 114.13,98.74 R1.2
FLASH_CS
  Bottom 0.203: R2.2 109.3,104.42 U1.1 108.72,103.62 107.85,102.74 107.85,101.7 107.36,101.22 101.16,101.22 U$4.39
FLASH_MISO  (via drill 0.39)
  Top 0.203: v103.13,96 104.61,97.47 v104.61,100.25
  Bottom 0.203: U1.2 108.81,103.12 108.29,102.6 108.29,101.55 107,100.25 v104.61,100.25 | U$4.48 101.63,96.69 102.32,96 v103.13,96
FLASH_MOSI
  Bottom 0.203: U1.5 105.87,102.12 105.81,102.17 101.18,102.17 U$4.37
FLASH_SCK
  Bottom 0.203: U$4.38 101.19,101.66 107.2,101.66 107.4,101.87 107.4,102.36 107.14,102.62 U1.6
GND  (via drill 0.39)
  Top 0.203: v62.3,104.34 v62.3,106.25 | v4.9,52.02 v2.87,52.02 | v68.07,4.83 v68.07,2.84 | v105.81,102.93 103.57,102.93 v102,104.5
  Bottom 0.203: 97.69,99.56 97.68,99.57 | U1.4 109.61,102.12 109.75,101.98 110.01,101.98 v110.39,101.6 | U$4.18 93.36,99.19 | 93.36,99.19 92.86,99.7 92.86,100.16 SW1.4 | 93.36,99.19 92.23,98.05 92.23,98.04 91.69,97.5 SW1.2 | L7.4 62.32,104.36 v62.3,104.34 | L3.4 v68.06,4.84 v68.07,4.83
  Bottom 0.305: U2.2 113.18,96.71 113.5,96.39
  Bottom 0.406: J1.S4 J1.SH4 | J1.S5 J1.SH3
  other vias: 113.88,96.08
  pour Bottom: 124.48,-1.91 -2.9,-1.91 -2.9,112.01 124.48,112.01
N$1
  Bottom 0.203: U$4.1 100.44,86.66 102.26,84.84 110.89,84.84 113.37,87.31 L2.5
N$2
  Bottom 0.203: R7.2 91.55,104.66 L.A
N$3
  Bottom 0.203: L1.6 118.31,7.75 118.31,85.8 117.55,86.56 L2.1
N$4
  Bottom 0.203: L1.5 118.51,5.59 119.66,6.73 119.66,86.61 118.96,87.31 L2.2
N$5
  Bottom 0.203: U$4.2 99.94,86.44 102.18,84.2 111.28,84.2 113.64,86.56 L2.6
N$6
  Bottom 0.203: L3.6 L1.1
N$7
  Bottom 0.203: L3.5 L1.2
N$8
  Bottom 0.203: L4.6 6.36,4.38 7.01,3.73 60.25,3.73 62.86,6.35 65.1,6.35 L3.1
N$9
  Bottom 0.203: L4.5 5.61,3.94 6.5,3.05 60.5,3.05 63.04,5.59 L3.2
N$10
  Bottom 0.203: L5.6 6.36,48.91 6.37,48.89 6.37,6.55 L4.1
N$11
  Bottom 0.203: L5.5 L4.2
N$12
  Bottom 0.203: L6.6 4.66,101.41 4.98,101.09 4.98,59.49 6.36,58.1 L5.1
N$13
  Bottom 0.203: L6.5 4.06,103.61 3.58,103.12 3.58,100.46 4.34,99.7 4.34,97.92 3.58,97.16 3.58,59.92 5.61,57.89 L5.2
N$14
  Bottom 0.203: L7.6 L6.1
N$15
  Bottom 0.203: L7.5 L6.2
SWCLK
  Bottom 0.203: U$4.45 106.81,98.19 110.77,94.23 JP2.4
SWDIO
  Bottom 0.203: U$4.46 106.29,97.69 108.23,95.76 JP2.2
VBUS
  Bottom 0.406: D2.A 114.7,102.87 116.33,101.25 J1.1
VDDCORE
  Bottom 0.203: C1.1 108.06,100.33 107.4,99.67 105.94,99.67 105.46,99.19 U$4.43
VHI
  Bottom 0.305: D2.C 111.21,102.87 113.68,100.4 C6.1 112.27,98.96 R1.1 112.27,97.41 U2.1

### Text on the board
bNames: SW1 | SWDIO | SWCLK | GND | 3V3 | v0.1